# EasyEDA schematic SCH_CarAccessoryKitV1.0_2024-07-24.json
TITLE: Car Accessory Kit; REV: 1.0; Date: 2024-07-22; Sheet: 1/1; Drawn By: williammarktaylor; Company: WMTaylor
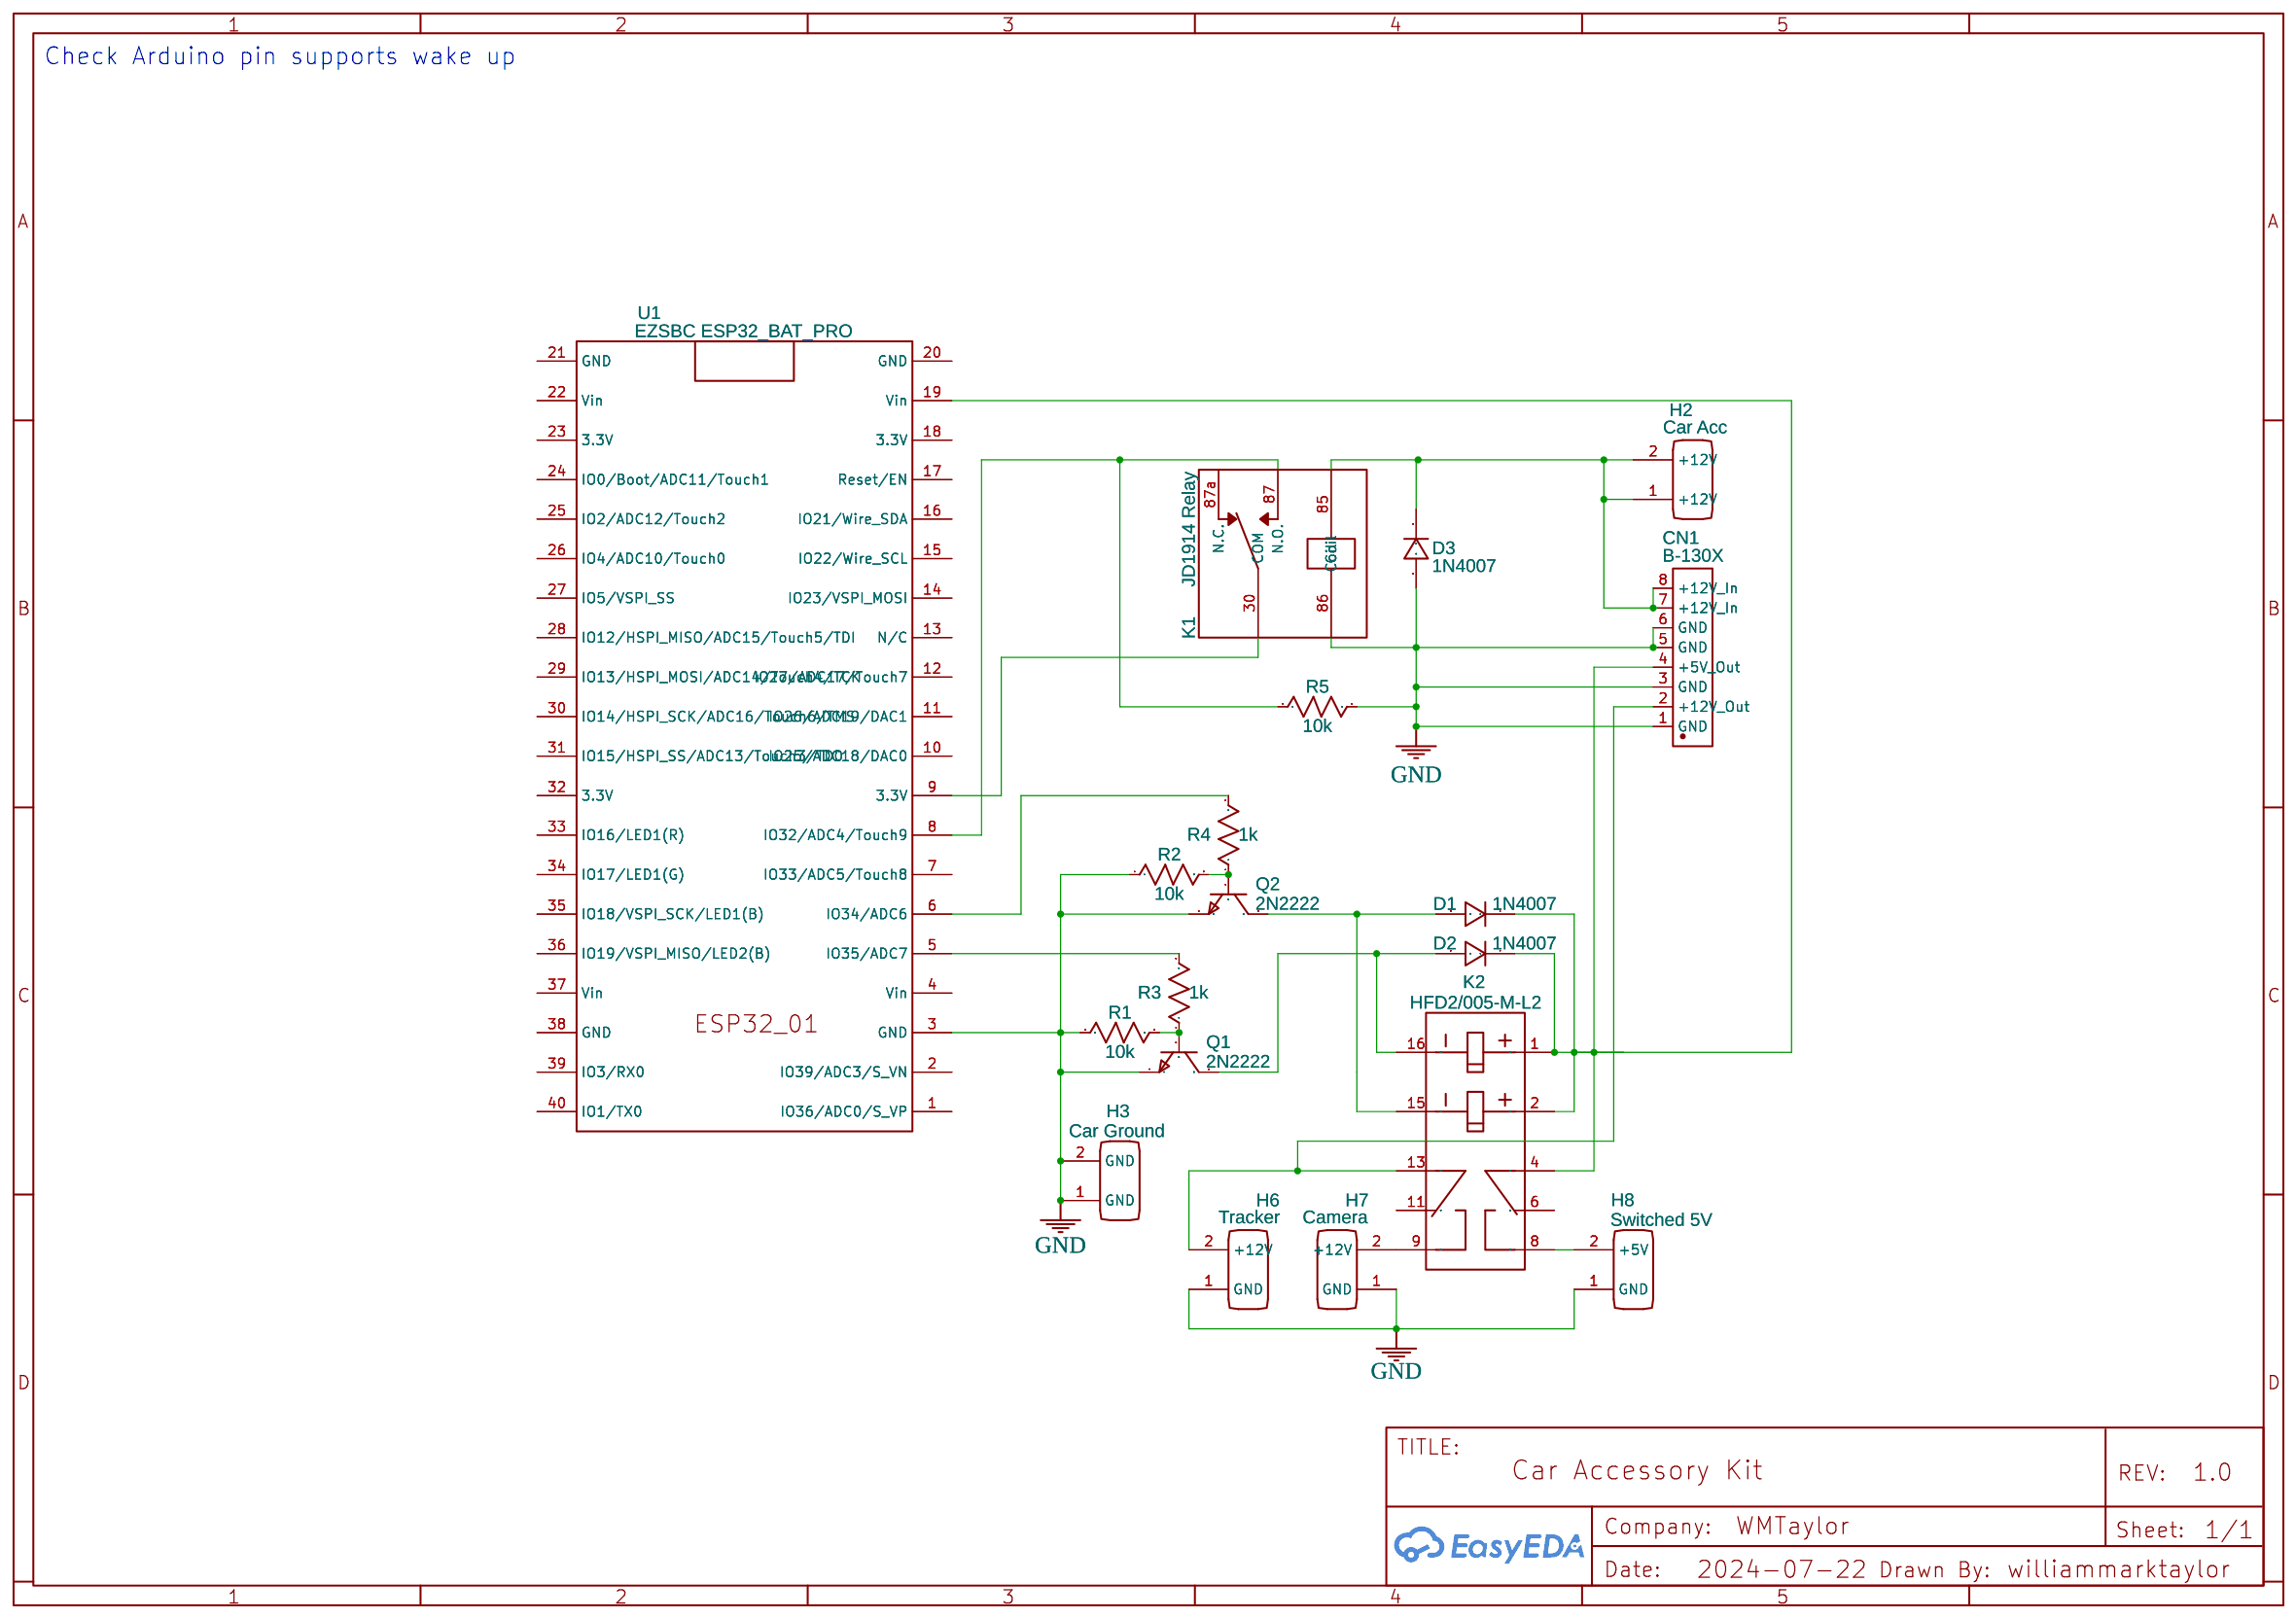
[diagram p0: schematic sheet]

## Parts
CN1  B-130X  [CONN-TH_8P-P3.96_CH3.96-8A]
D1  1N4007  [DO-41_BD2.4-L4.7-P8.70-D0.9-RD]
D2  1N4007  [DO-41_BD2.4-L4.7-P8.70-D0.9-RD]
D3  1N4007  [DO-41_BD2.4-L4.7-P8.70-D0.9-RD]
H2  Car Acc  [JST_VH-2P-3.96]
H3  Car Ground  [JST_VH-2P-3.96]
H6  Tracker  [JST_VH-2P-3.96]
H7  Camera  [JST_VH-2P-3.96]
H8  Switched 5V  [JST_VH-2P-3.96]
K1  JD1914 Relay  [JD1914]
K2  HFD2/005-M-L2  [RELAY-TH_HFD2-X-X-L2-X]
Q1  2N2222  [2N2222]
Q2  2N2222  [2N2222]
R1  10k  [R_AXIAL-0.3]
R2  10k  [R_AXIAL-0.3]
R3  1k  [R_AXIAL-0.3]
R4  1k  [R_AXIAL-0.3]
R5  10k  [R_AXIAL-0.3]
U1  EZSBC ESP32_BAT_PRO  [EZSBC ESP32_01]

## Library data of the parts
CN1 = CH3.96-8A: Supplier: LCSC; Manufacturer: BOOMELE; Supplier Part: C10383; JLCPCB Part Class: Extended Part
D1-D3 = 1N4007: Supplier: LCSC; Manufacturer: SEMTECH; Supplier Part: C106903; Contributor: LCEDA_Lib
H2 H3 H6-H8 = JST_VH-2P-3.96: Supplier: LOCAL; Contributor: sanariyarajesh1981
K1 = RELAY JD1914 12V 80A: Manufacturer: BenFeng; Supplier: Aliexpress; link: http://www.msrelay.com/Auto_Relay/118.html; Contributor: thien1900
K2 = HFD2/005-M-L2: Contributor: williammarktaylor; Supplier: LCSC; Supplier Part: C399485; Manufacturer: HF(宏发); JLCPCB Part Class: Extended Part
Q1 Q2 = 2N2222: Supplier: ALIEXPRESS; Contributor: BenjaminL
R1-R5 = R_AXIAL-0.3_US: Contributor: LCEDA_Lib
U1 = EZSBC ESP32_01: Manufacturer: EZSBC; Manufacturer Part: ESP32_01; Supplier Part: ESP32_01; Contributor: brad.lotsberg

## Nets
GND: CN1.1(GND) CN1.3(GND) CN1.5(GND) CN1.6(GND) D3.2 H3.1(GND) H3.2(GND) H6.1(GND) H7.1(GND) H8.1(GND) K1.86(Coil) Q1.1(E) Q2.1(E) R1.1 R2.1 R5.2 U1.3(GND)
Net-(CN1-2): CN1.2(+12V Out) H6.2(+12V) K2.13
Net-(CN1-4): CN1.4(+5V Out) D1.1 D2.1 K2.1 K2.2 K2.4 U1.19(Vin)
Net-(CN1-7): CN1.7(+12V In) CN1.8(+12V In) D3.1 H2.1(+12V) H2.2(+12V) K1.85(Coil)
Net-(D1-2): D1.2 K2.15 Q2.3(C)
Net-(D2-2): D2.2 K2.16 Q1.3(C)
Net-(H7-2): H7.2(+12V) K2.9
Net-(H8-2): H8.2(+5V) K2.8
Net-(K1-30): K1.30(COM) U1.9(3.3V)
Net-(K1-87): K1.87(N.O.) R5.1 U1.8(IO32/ADC4/Touch9)
Net-(Q1-2): Q1.2(B) R1.2 R3.1
Net-(Q2-2): Q2.2(B) R2.2 R4.1
Net-(R3-2): R3.2 U1.5(IO35/ADC7)
Net-(R4-2): R4.2 U1.6(IO34/ADC6)

Not connected (* = marked no-connect by the designer): K1 87a(N.C.); K2 6 11; U1 1(IO36/ADC0/S_VP) 2(IO39/ADC3/S_VN) 4(Vin) 7(IO33/ADC5/Touch8) 10(IO25/ADC18/DAC0) 11(IO26/ADC19/DAC1) 12(IO27/ADC17/Touch7) 13(N/C) 14(IO23/VSPI MOSI) 15(IO22/Wire SCL) 16(IO21/Wire SDA) 17(Reset/EN) 18(3.3V) 20(GND) 21(GND) 22(Vin) 23(3.3V) 24(IO0/Boot/ADC11/Touch1) 25(IO2/ADC12/Touch2) 26(IO4/ADC10/Touch0) 27(IO5/VSPI SS) 28(IO12/HSPI MISO/ADC15/Touch5/TDI) 29(IO13/HSPI MOSI/ADC14/Touch4/TCK) 30(IO14/HSPI SCK/ADC16/Touch6/TMS) 31(IO15/HSPI SS/ADC13/Touch3/TD0) 32(3.3V) 33(IO16/LED1(R)) 34(IO17/LED1(G)) 35(IO18/VSPI SCK/LED1(B)) 36(IO19/VSPI MISO/LED2(B)) 37(Vin) 38(GND) 39(IO3/RX0) 40(IO1/TX0)

## Notes on the sheet
- Check Arduino pin supports wake up
